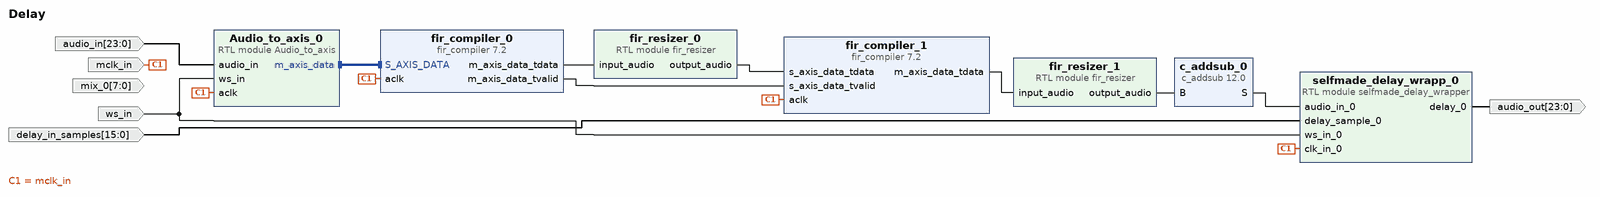
[diagram p0: block diagram of the top level]
# Vivado block design Delay, xc7a100tcsg324-1, Vivado 2022.1
create_bd_design Delay

create_bd_port -dir I -from 7 -to 0 mix_0
create_bd_port -dir I -from 23 -to 0 audio_in
create_bd_port -dir O -from 23 -to 0 audio_out
create_bd_port -dir I -from 15 -to 0 delay_in_samples
create_bd_port -dir I ws_in
create_bd_port -dir I -type clk mclk_in
set_property -dict {CONFIG.FREQ_HZ 11289000} [get_bd_ports mclk_in]

create_bd_cell -type module -reference fir_resizer fir_resizer_1
create_bd_cell -type module -reference fir_resizer fir_resizer_0
create_bd_cell -type ip -vlnv xilinx.com:ip:c_addsub:12.0 c_addsub_0
set_property -dict [list \
  CONFIG.A_Type Unsigned \
  CONFIG.A_Width 24 \
  CONFIG.B_Constant false \
  CONFIG.B_Type Unsigned \
  CONFIG.B_Value 000000000000000000000000 \
  CONFIG.B_Width 24 \
  CONFIG.CE false \
  CONFIG.Latency 0 \
  CONFIG.Out_Width 24 \
] [get_bd_cells c_addsub_0]
create_bd_cell -type ip -vlnv xilinx.com:ip:fir_compiler:7.2 fir_compiler_1
set_property -dict [list \
  CONFIG.Clock_Frequency 11.29 \
  CONFIG.CoefficientSource COE_File \
  CONFIG.Coefficient_File ../../../../../highpass.coe \
  CONFIG.Coefficient_Fractional_Bits 0 \
  CONFIG.Coefficient_Sets 1 \
  CONFIG.Coefficient_Sign Signed \
  CONFIG.Coefficient_Structure Inferred \
  CONFIG.Coefficient_Width 16 \
  CONFIG.Filter_Architecture Systolic_Multiply_Accumulate \
  CONFIG.Output_Rounding_Mode Truncate_LSBs \
  CONFIG.Output_Width 26 \
  CONFIG.Quantization Integer_Coefficients \
  CONFIG.Sample_Frequency 0.044 \
] [get_bd_cells fir_compiler_1]
create_bd_cell -type ip -vlnv xilinx.com:ip:fir_compiler:7.2 fir_compiler_0
set_property -dict [list \
  CONFIG.Clock_Frequency 11.29 \
  CONFIG.CoefficientSource COE_File \
  CONFIG.Coefficient_File ../../../../../lowpass.coe \
  CONFIG.Coefficient_Fractional_Bits 0 \
  CONFIG.Coefficient_Sets 1 \
  CONFIG.Coefficient_Sign Signed \
  CONFIG.Coefficient_Structure Inferred \
  CONFIG.Coefficient_Width 16 \
  CONFIG.Data_Width 24 \
  CONFIG.Filter_Architecture Systolic_Multiply_Accumulate \
  CONFIG.Output_Rounding_Mode Truncate_LSBs \
  CONFIG.Output_Width 26 \
  CONFIG.Quantization Integer_Coefficients \
  CONFIG.Sample_Frequency 0.044 \
] [get_bd_cells fir_compiler_0]
create_bd_cell -type module -reference selfmade_delay_wrapper selfmade_delay_wrapp_0
create_bd_cell -type module -reference Audio_to_axis Audio_to_axis_0

# ---- connections ----

connect_bd_intf_net [get_bd_intf_pins fir_compiler_0/S_AXIS_DATA] [get_bd_intf_pins Audio_to_axis_0/m_axis_data]
connect_bd_net -net audio_in_l_0_1 [get_bd_ports audio_in] [get_bd_pins Audio_to_axis_0/audio_in]
connect_bd_net [get_bd_pins c_addsub_0/S] [get_bd_pins selfmade_delay_wrapp_0/audio_in_0]
connect_bd_net -net clk_in_0_1 [get_bd_ports mclk_in] \
  [get_bd_pins fir_compiler_1/aclk] [get_bd_pins fir_compiler_0/aclk] [get_bd_pins selfmade_delay_wrapp_0/clk_in_0] \
  [get_bd_pins Audio_to_axis_0/aclk]
connect_bd_net -net delay_sample_0_0_1 [get_bd_ports delay_in_samples] [get_bd_pins selfmade_delay_wrapp_0/delay_sample_0]
connect_bd_net [get_bd_pins fir_compiler_0/m_axis_data_tdata] [get_bd_pins fir_resizer_0/input_audio]
connect_bd_net [get_bd_pins fir_compiler_0/m_axis_data_tvalid] [get_bd_pins fir_compiler_1/s_axis_data_tvalid]
connect_bd_net [get_bd_pins fir_compiler_1/m_axis_data_tdata] [get_bd_pins fir_resizer_1/input_audio]
connect_bd_net -net fir_resizer_0_output [get_bd_pins fir_resizer_0/output_audio] [get_bd_pins fir_compiler_1/s_axis_data_tdata]
connect_bd_net -net fir_resizer_1_output [get_bd_pins fir_resizer_1/output_audio] [get_bd_pins c_addsub_0/B]
connect_bd_net -net selfmade_delay_1_delay_0 [get_bd_pins selfmade_delay_wrapp_0/delay_0] [get_bd_ports audio_out]
connect_bd_net -net ws_in_0_1 [get_bd_ports ws_in] [get_bd_pins selfmade_delay_wrapp_0/ws_in_0] [get_bd_pins Audio_to_axis_0/ws_in]

validate_bd_design
save_bd_design
